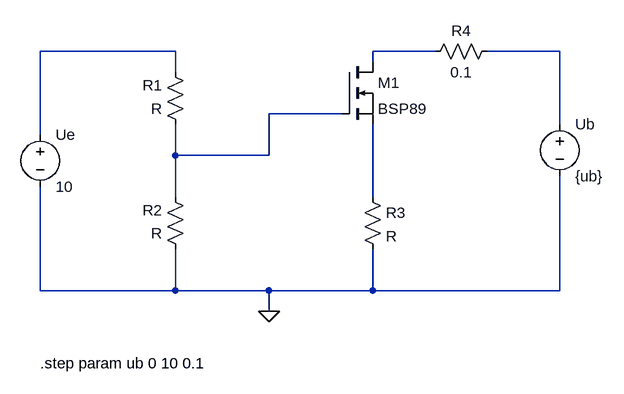
[diagram p0: schematic MOSFET.asc]
MOSFET.asc, the LTspice schematic file:
Version 4
SHEET 1 880 680
WIRE 128 16 -80 16
WIRE 528 16 432 16
WIRE 720 16 608 16
WIRE 432 32 432 16
WIRE 128 48 128 16
WIRE 384 112 272 112
WIRE 720 128 720 16
WIRE -80 144 -80 16
WIRE 128 176 128 128
WIRE 272 176 272 112
WIRE 272 176 128 176
WIRE 128 240 128 176
WIRE 432 240 432 128
WIRE -80 384 -80 224
WIRE 128 384 128 320
WIRE 128 384 -80 384
WIRE 272 384 128 384
WIRE 432 384 432 320
WIRE 432 384 272 384
WIRE 720 384 720 208
WIRE 720 384 432 384
WIRE 272 416 272 384
FLAG 272 416 0
SYMBOL res 144 144 R180
WINDOW 0 36 76 Left 2
WINDOW 3 36 40 Left 2
SYMATTR InstName R1
SYMBOL res 144 336 R180
WINDOW 0 36 76 Left 2
WINDOW 3 36 40 Left 2
SYMATTR InstName R2
SYMBOL nmos 384 32 R0
SYMATTR InstName M1
SYMATTR Value BSP89
SYMBOL res 416 224 R0
SYMATTR InstName R3
SYMBOL LTspice_EuroComponents\\voltage -80 128 R0
SYMATTR InstName Ue
SYMATTR Value 10
SYMBOL LTspice_EuroComponents\\voltage 720 112 R0
SYMATTR InstName Ub
SYMATTR Value {ub}
SYMBOL res 624 0 R90
WINDOW 0 0 56 VBottom 2
WINDOW 3 32 56 VTop 2
SYMATTR InstName R4
SYMATTR Value 0.1
TEXT -80 496 Left 2 !.step param ub 0 10 0.1

The netlist it stands for:
* MOSFET.asc
R1 N004 N001 R
R2 0 N004 R
M1 N002 N004 N005 N005 BSP89
R3 N005 0 R
V§Ue N001 0 10
V§Ub N003 0 {ub}
R4 N003 N002 0.1
.model NMOS NMOS
.model PMOS PMOS
.lib standard.mos
.step param ub 0 10 0.1
.backanno
.end